# Altium schematic sheet Potentiometer.SchDoc
size A4
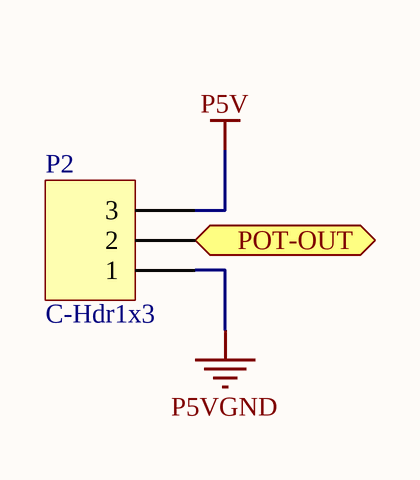
[diagram p0: Potentiometer.SchDoc]

## Parts
P2  C-Hdr1x3  [HDR1X3_LGE1.0]

## Ports
POT-OUT (out)

## Nets
P5V: P2.3
P5VGND: P2.1
POT-OUT: P2.2 ; port POT-OUT

## Library data of the parts
P2 = C-Hdr1x3: Header, 4-Pin; LatestRevisionDate: 17-Jul-2002; LatestRevisionNote: Re-released for DXP Platform.; Publisher: Altium Limited